# Altium schematic sheet Sheet1.SchDoc
size A4
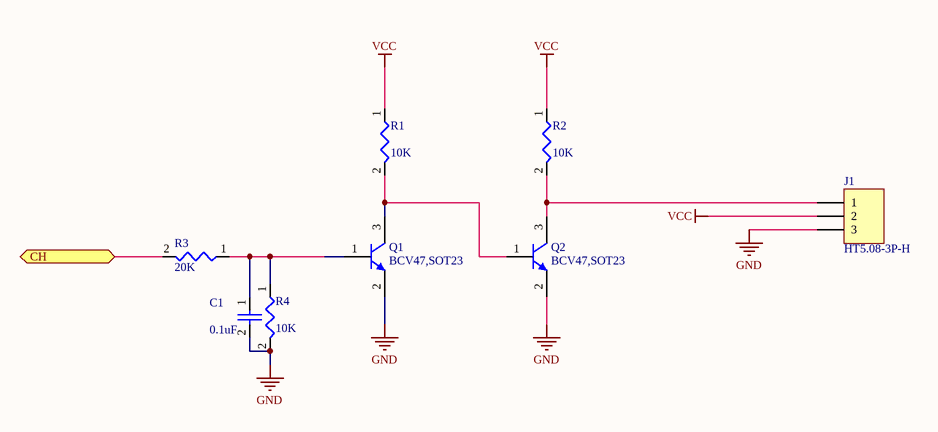
[diagram p0: Sheet1.SchDoc]

## Parts
C1  value 0.1uF  [C0805]  (hidden comment: CAP 0.1uF 50V 0805(2012))
J1  HT5.08-3P-H  [HT5.08-3P-H]
Q1  BCV47,SOT23  [INF-SOT23_L]
Q2  BCV47,SOT23  [INF-SOT23_L]
R1  value 10K  [R0805]  (hidden comment: RES 10K 5% 0805(2012))
R2  value 10K  [R0805]  (hidden comment: RES 10K 5% 0805(2012))
R3  value 20K  [R0805]  (hidden comment: RES 20K 5% 0805(2012))
R4  value 10K  [R0805]  (hidden comment: RES 10K 5% 0805(2012))

## Ports
CH

## Nets
GND: C1.2 J1.3 Q1.2(E) Q2.2(E) R4.2
VCC: J1.2 R1.1 R2.1
CH: R3.2 ; port CH
NetC1_1: C1.1 Q1.1(B) R3.1 R4.1
NetJ1_1: J1.1 Q2.3(C) R2.2
NetQ1_3: Q1.3(C) Q2.1(B) R1.2

## Library data of the parts
C1 = EC00014: CAP SMD CR X7R 50V 10% 0.1uF 0805 ROHS; Manufacturer: YAGEO; Manufacturer P/N: CC0805KRX7R9BB104; ID: 14; HelpURL: *; P/N: EC00014
J1 = Header 3: Header, 3-Pin; LatestRevisionDate: 17-Jul-2002; LatestRevisionNote: Re-released for DXP Platform.; Publisher: Altium Limited
Q1 Q2 = CMP-1196-00014-1: NPN Silicon Darlington Transistor, 60 V VCEO, 500 mA IC, SOT23, Reel, Green; Manufacturer: Infineon; fT (typ): 170 MHz; IC (max): 500 mA; ICBO (max): 10 uA; Green: TRUE; VCE: 5 V; hFE (min): 2000; ICM (max): 800 mA; VCBO (max): 80 V; IC: 100 mA; VCEO (max): 60 V; VEBO (max): 10 V; ComponentLink1URL: http://www.infineon.com/; PackageVersion: Apr-08; ComponentLink2URL: http://www.infineon.com/dgdl/bcv27_bcv47.pdf?folderId=db3a30431441fb5d011445c30f210183&fileId=db3a30431441fb5d011445cf7c3b0188; ComponentLink2Description: Datasheet; ComponentLink1Description: Manufacturer URL; PartNumber: BCV47; Polarity: NPN; PackageReference: SOT23; PackageDescription: 3-Pin Small Outline Transistor Package, 1.3 x 2.9 mm Body, 0.95 mm Pitch; ComponentLink3URL: http://www.infineon.com/dgdl/SOT23-Package_Overview.pdf?folderId=db3a30431936bc4b0119532290053c66&fileId=db3a30431936bc4b0119533468123c85; Mounting Technology: Surface Mount; Packing: Reel; ComponentLink3Description: Package Specification
R1 R2 R4 = ER00213: RES THICK_FILM SMD 10K ohm 5% 1/10W ROHS 0603; Manufacturer: YAGEO; Manufacturer P/N: RC0603JR-1310KL; ID: 213; HelpURL: \\192.168.1.3\Esh\Department\RD\CAD\Component\Resistor\SMD\YAGEO_PYu-RC1206_51_RoHS_L_4.pdf; P/N: ER00213
R3 = ER00035: RES THICK_FILM SMD 100 OHM 5% 1/8W ROHS 0805; Manufacturer: YAGEO; Manufacturer P/N: RC0805JR-07100RL; ID: 35; HelpURL: *; P/N: ER00035